# EasyEDA schematic SCH_kea.json
TITLE: Sheet_1; REV: 1.0; Date: 2022-12-06; Sheet: 1/1; Drawn By: akilmhyltonel; Company: icspace.ai
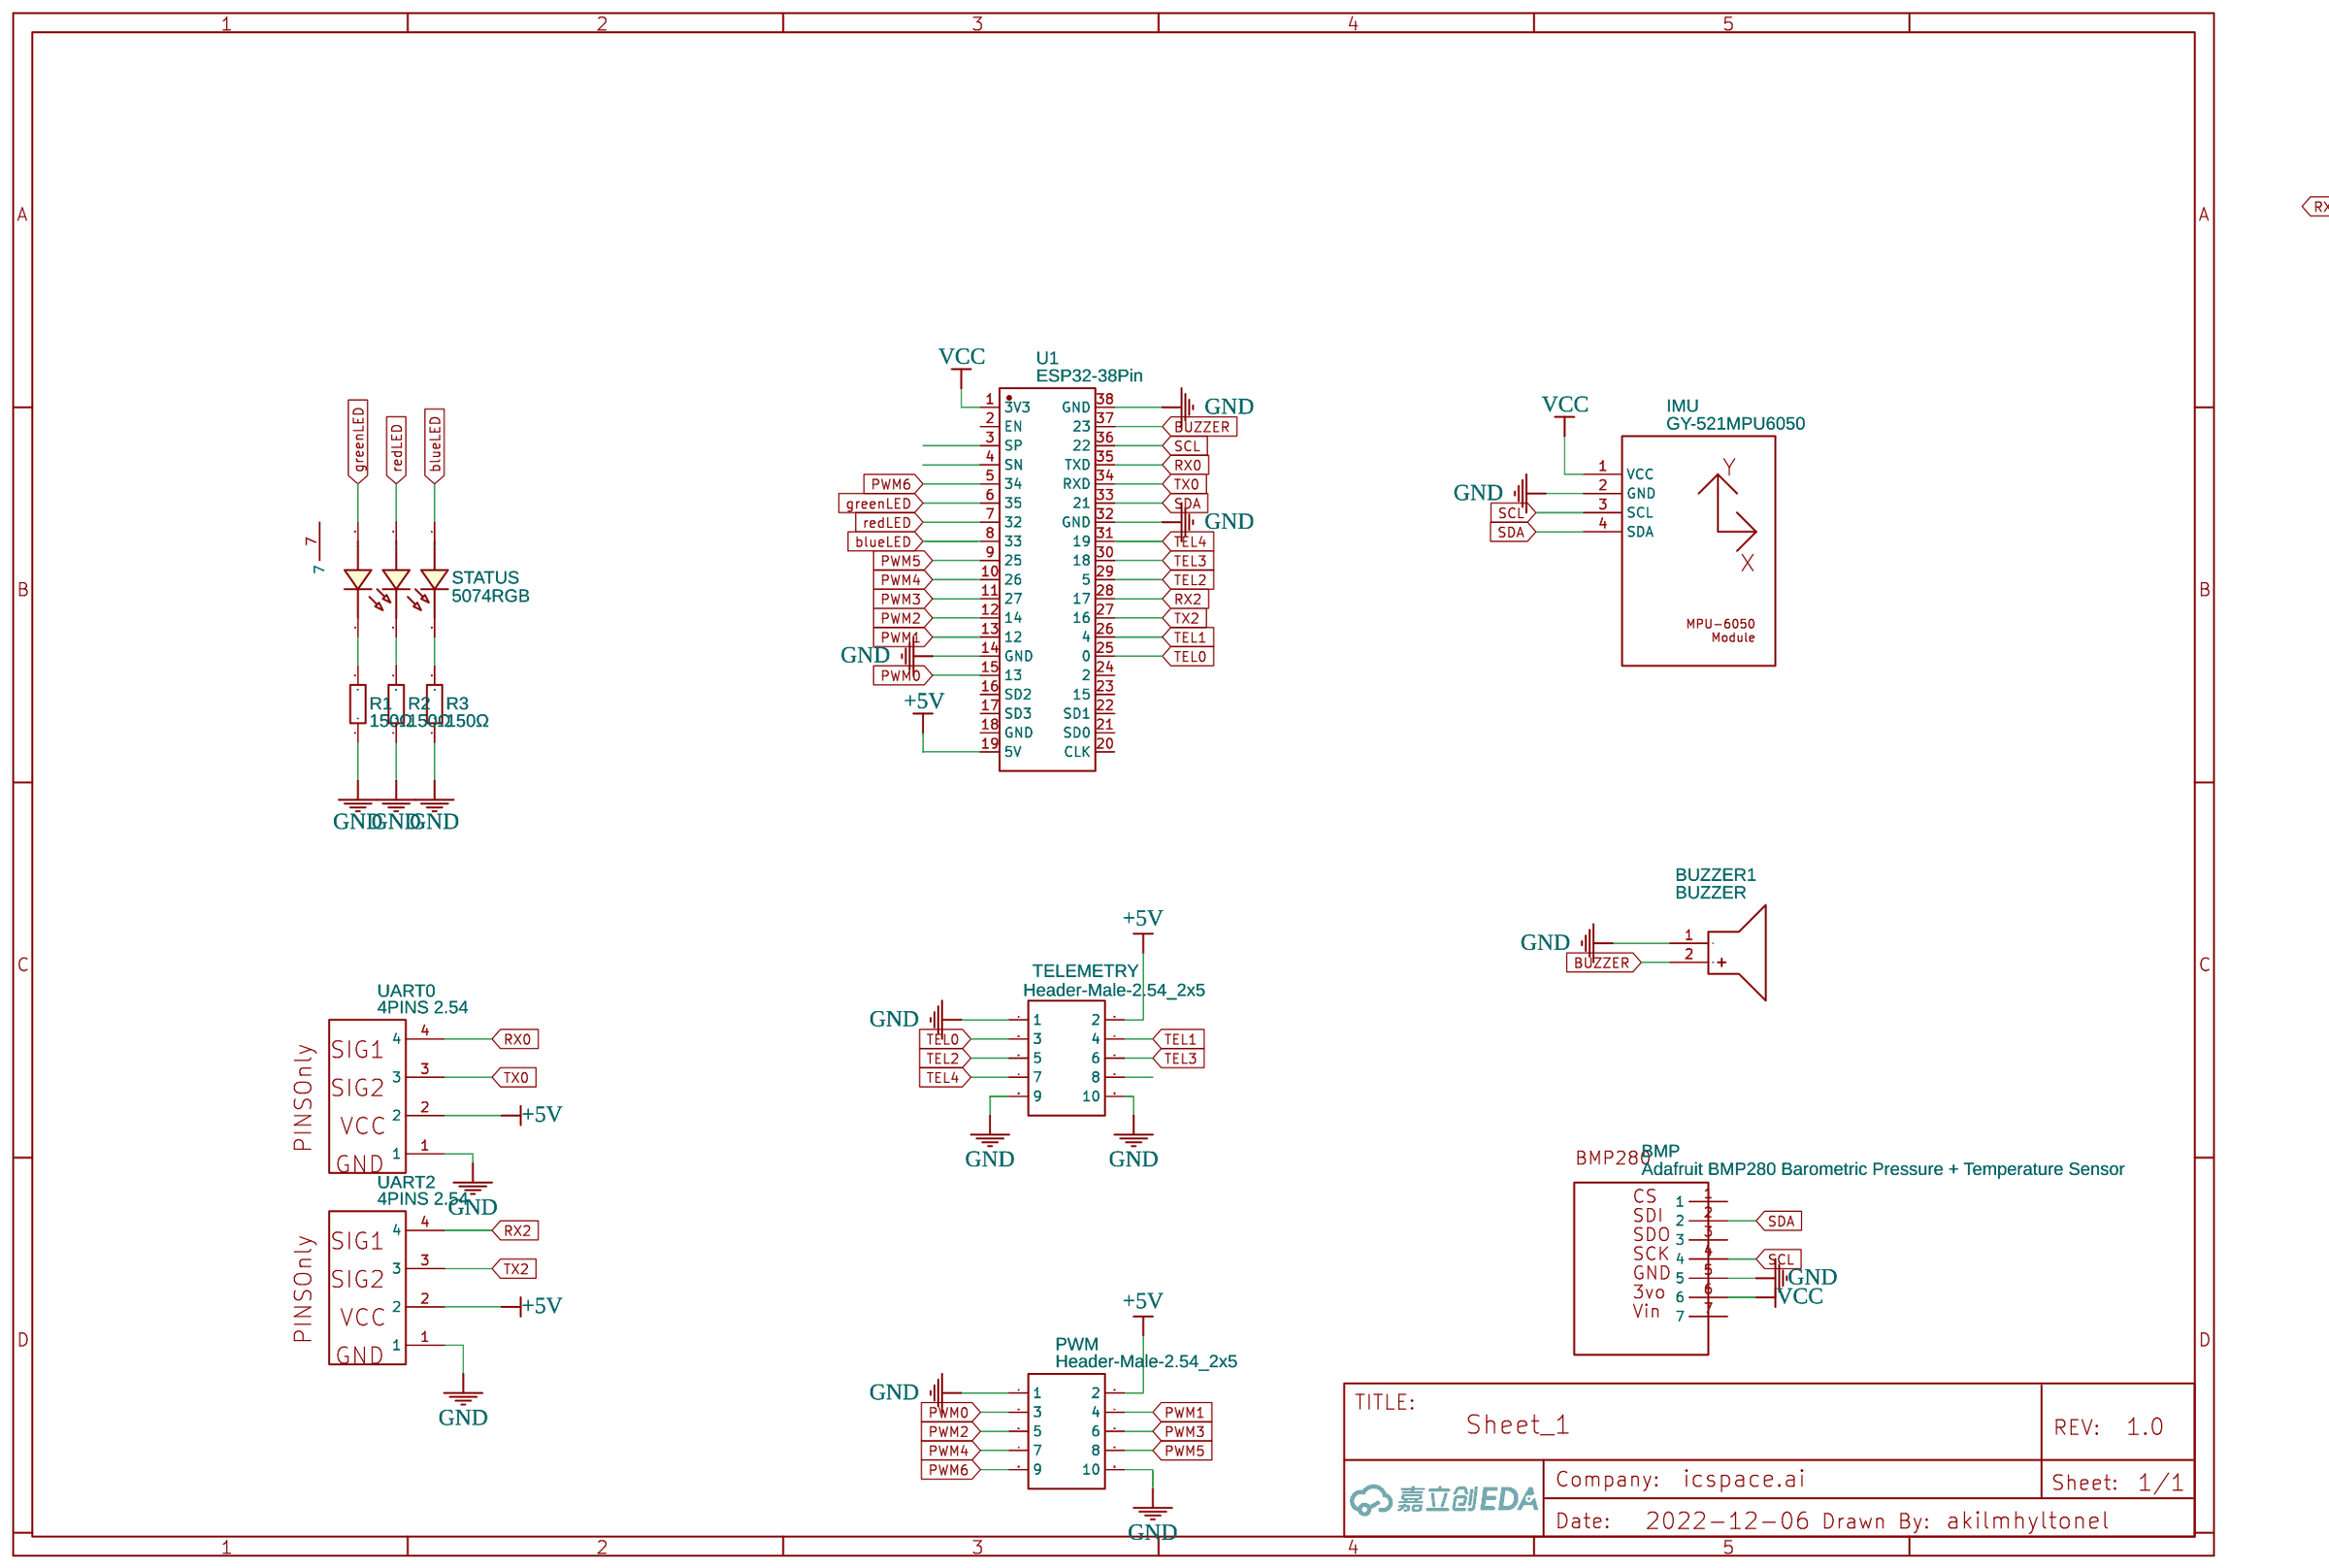
[diagram p0: schematic sheet]

## Parts
BMP  Adafruit BMP280 Barometric Pressure + Temperature Sensor  [BMP280FT]
BUZZER1  BUZZER  [BUZ-TH_BD12.0-P6.00-D0.9-RD]
IMU  GY-521MPU6050  [MPU6050]
PWM  Header-Male-2.54_2x5  [HDR-TH_10P-P2.54-V-M-R2-C5-S2.54]
R1  150Ω  [R0603]
R2  150Ω  [R0603]
R3  150Ω  [R0603]
STATUS  5074RGB  [LED-SMD_6P-L5.0-W5.0-LS7.4_5074RGB]
TELEMETRY  Header-Male-2.54_2x5  [HDR-TH_10P-P2.54-V-M-R2-C5-S2.54]
U1  ESP32-38Pin  [ESP32-38PIN-DEVBOARD]
UART0  4PINS 2.54  [4 PINS 2.54]
UART2  4PINS 2.54  [4 PINS 2.54]

## Library data of the parts
BMP = Adafruit BMP280 Barometric Pressure + Temperature Sensor: Manufacturer: Adafruit; Manufacturer Part: Adafruit; link: https://learn.adafruit.com/adafruit-bmp280-barometric-pressure-plus-temperature-sensor-breakout/pinouts; Contributor: josh6f
BUZZER1 = BUZZER: Supplier: LCSC; Supplier Part: C9900014030; Manufacturer: null; Manufacturer Part: buzzer; JLCPCB Part Class: Extended Part; Contributor: lcsc
IMU = GY-521MPU6050: Contributor: Alex Co; sourceId: vtnFWQ8qI
PWM TELEMETRY = Header-Male-2.54_2x5: Supplier: LCSC; Manufacturer Part: 2*5pHeaders  Pins 2.54mm; Supplier Part: C28207; JLCPCB Part Class: Extended Part
R1-R3 = AECR0603F160KK9: Supplier: LCSC; Supplier Part: C352365; Manufacturer: RESI(开步睿思）; Resistance (Ohms): 160K; Contributor: LCSC; JLCPCB Part Class: Extended Part
STATUS = 5074RGB: Supplier: LCSC; Supplier Part: C9900017134; Manufacturer: null; JLCPCB Part Class: Extended Part; Contributor: lcsc
U1 = ESP32-38Pin: Supplier: ESP32; Contributor: peewu98
UART0 UART2 = 4PINS 2.54: Contributor: Tdefosse

## Nets
+5V: PWM.2 TELEMETRY.2 U1.19(5V) UART0.2 UART2.2
GND: BMP.5 BUZZER1.1(-) IMU.2(GND) PWM.1 PWM.10 R1.1 R2.1 R3.1 TELEMETRY.1 TELEMETRY.9 TELEMETRY.10 U1.14(GND) U1.32(GND) U1.38(GND) UART0.1 UART2.1
VCC: BMP.6 IMU.1(VCC) U1.1(3V3)
blueLED: STATUS.4(+) U1.8(33)
BUZZER: BUZZER1.2(+) U1.37(23)
greenLED: STATUS.6(+) U1.6(35)
PWM0: PWM.3 U1.15(13)
PWM1: PWM.4 U1.13(12)
PWM2: PWM.5 U1.12(14)
PWM3: PWM.6 U1.11(27)
PWM4: PWM.7 U1.10(26)
PWM5: PWM.8 U1.9(25)
PWM6: PWM.9 U1.5(34)
redLED: STATUS.5(+) U1.7(32)
RX0: U1.35(TXD) UART0.4
RX2: U1.28(17) UART2.4
SCL: BMP.4 IMU.3(SCL) U1.36(22)
SDA: BMP.2 IMU.4(SDA) U1.33(21)
TEL0: TELEMETRY.3 U1.25(0)
TEL1: TELEMETRY.4 U1.26(4)
TEL2: TELEMETRY.5 U1.29(5)
TEL3: TELEMETRY.6 U1.30(18)
TEL4: TELEMETRY.7 U1.31(19)
TX0: U1.34(RXD) UART0.3
TX2: U1.27(16) UART2.3
Net-(R1-2): R1.2 STATUS.3(-)
Net-(R2-2): R2.2 STATUS.2(-)
Net-(R3-2): R3.2 STATUS.1(-)

Not connected (* = marked no-connect by the designer): BMP 1 3 7; STATUS 7; TELEMETRY 8; U1 2(EN) 3(SP) 4(SN) 16(SD2) 17(SD3) 18(GND) 20(CLK) 21(SD0) 22(SD1) 23(15) 24(2)
